# EAGLE design starterkit_v2 (EAGLE 6.5.0)
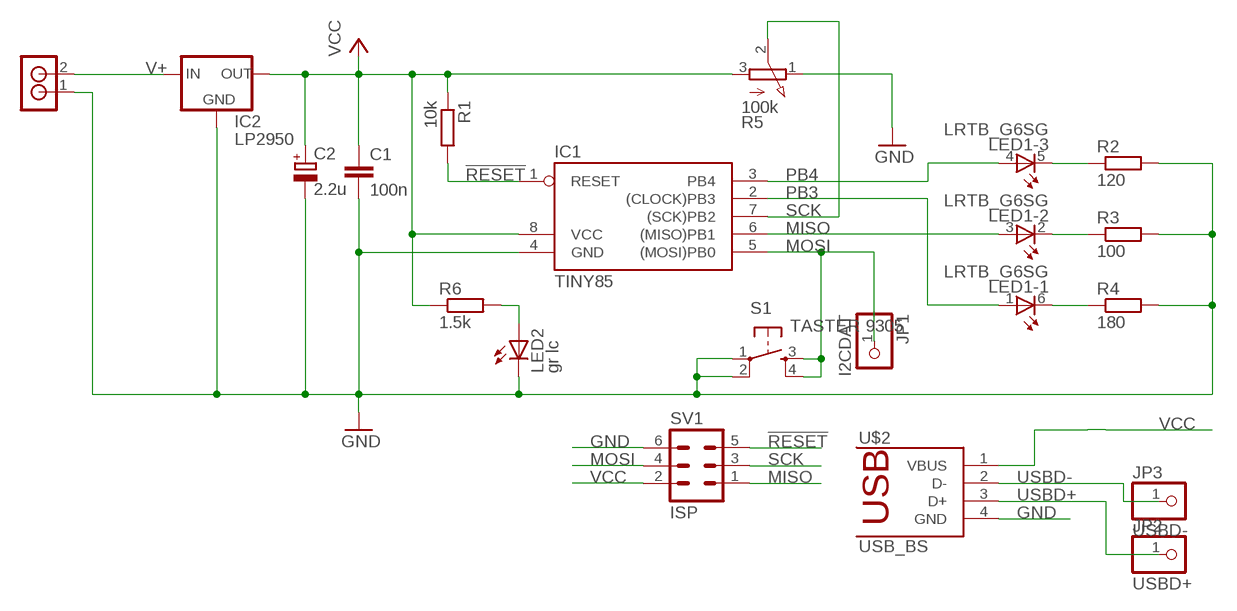
[diagram p0: schematic, sheet 1]

## Parts
C1  100n  C-EUC0805  [C0805]
C2  2.2u  CPOL-EUE2-5  [E2-5]
IC1  TINY85  TINY22P  [DIL08]
IC2  LP2950  LP2950ACZ-5.0  [TO92]
JP1  I2CDAT  PINHD-1X1  [1X01]
JP2  USBD+  PINHD-1X1  [1X01]
JP3  USBD-  PINHD-1X1  [1X01]
LED1  LRTB_G6SG  [LRTB_G6SG]
LED2  gr lc  LED3MM  [LED3MM]
R1  10k  R-EU_R0805  [R0805]
R2  120  R-EU_R0805  [R0805]
R3  100  R-EU_R0805  [R0805]
R4  180  R-EU_R0805  [R0805]
R5  100k  ALPS_RK09K113  [ALPS_RK09K113]
R6  1.5k  R-EU_R0805  [R0805]
S1  TASTER 9305  JTP-1130C  [JTP-1130]
SV1  ISP  ML6  [ML6]
U$1  RIACON_101_2  [RIACON_101_2]
U$2  USB_BS  [USB_B_UP-S]

## Nets
!RESET [signal]: IC1.1(RESET) R1.2 SV1.5
GND [supply]: C1.2 C2.- IC1.4(GND) IC2.2(GND) LED2.K(C) R2.2 R3.2 R4.2 R5.1(E) S1.1(P) S1.2(P1) SV1.6 U$1.1 U$2.4(GND)
MISO [signal]: IC1.6((MISO)PB1) LED1.3(-2:A) SV1.1
MOSI [signal]: IC1.5((MOSI)PB0) JP1.1 S1.3(S) S1.4(S1) SV1.4
N$1 [signal]: LED2.A R6.2
N$5 [signal]: LED1.5(-3:C) R2.1
N$6 [signal]: LED1.2(-2:C) R3.1
N$7 [signal]: LED1.6(-1:C) R4.1
PB3 [signal]: IC1.2((CLOCK)PB3) LED1.1(-1:A)
PB4 [signal]: IC1.3(PB4) LED1.4(-3:A)
SCK [signal]: IC1.7((SCK)PB2) R5.2(S) SV1.3
USBD+: JP2.1 U$2.3(D+)
USBD-: JP3.1 U$2.2(D-)
V+ [supply]: IC2.3(IN) U$1.2
VCC [supply]: C1.1 C2.+ IC1.8(VCC) IC2.1(OUT) R1.1 R5.3(A) R6.1 SV1.2 U$2.1(VBUS)

## Library data of the parts
C1 = rcl:C-EU: CAPACITOR, European symbol
C2 = rcl:CPOL-EU: POLARIZED CAPACITOR, European symbol
IC1 = atmel:TINY22: MICROCONTROLLER 1K ROM 128 bytes RAM 128 bytes EEPROM; OC_FARNELL: unknown; OC_NEWARK: unknown
IC2 = v-reg:LP2950?*: Source: http://cache.national.com/ds/LP/LP2950.pdf
JP1-JP3 = pinhead:PINHD-1X1: PIN HEADER
LED1 = led:LRTB_G6SG: LRTB G6SG 6-lead TOPLED® Source: OSRAM Opto Semiconductors ... LRTB_G6SG_Pb_free.pdf
LED2 = led:LED: LED OSRAM: - CHIPLED LG R971, LG N971, LY N971, LG Q971, LY Q971, LO R971, LY R971 LH N974, LH R974 LS Q976, LO Q976, LY Q976 LO Q996 - Hyper CHIPLED LW Q18S LB Q993, LB Q99A, LB R99A - SideLED LS A670, LO A670, LY A670, LG A670, LP A670 LB A673, LV A673, LT A673, LW A673 LH A674 LY A675 LS A676, LA A676, LO A676, LY A676, LW A676 LS A679, LY A679, LG A679 - Hyper Micro SIDELED® LS Y876, LA Y876, LO Y876, LY Y876 LT Y87S - SmartLED LW L88C, LW L88S LB L89C, LB L89S, LG L890 LS L89K, LO L89K, LY L89K LS L896, LA L896, LO L896, LY L896 - TOPLED LS T670, LO T670, LY T670, LG T670, LP T670 LSG T670, LSP T670, LSY T670, LOP T670, LYG T670 LG T671, LOG T671, LSG T671 LB T673, LV T673, LT T673, LW T673 LH T674 LS T676, LA T676, LO T676, LY T676, LB T676, LH T676, LSB T676, LW T676 LB T67C, LV T67C, LT T67C, LS T67K, LO T67K, LY T67K, LW E67C LS E67B, LA E67B, LO E67B, LY E67B, LB E67C, LV E67C, LT E67C LW T67C LS T679, LY T679, LG T679 LS T770, LO T770, LY T770, LG T770, LP T770 LB T773, LV T773, LT T773, LW T773 LH T774 LS E675, LA E675, LY E675, LS T675 LS T776, LA T776, LO T776, LY T776, LB T776 LHGB T686 LT T68C, LB T68C - Hyper Mini TOPLED® LB M676 - Mini TOPLED Santana® LG M470 LS M47K, LO M47K, LY M47K Source: http://www.osram.convergy.de LUXEON: - LUMILED® LXK2-PW12-R00, LXK2-PW12-S00, LXK2-PW14-U00, LXK2-PW14-V00 LXK2-PM12-R00, LXK2-PM12-S00, LXK2-PM14-U00 LXK2-PE12-Q00, LXK2-PE12-R00, LXK2-PE12-S00, LXK2-PE14-T00, LXK2-PE14-U00 LXK2-PB12-K00, LXK2-PB12-L00, LXK2-PB12-M00, LXK2-PB14-N00, LXK2-PB14-P00, LXK2-PB14-Q00 LXK2-PR12-L00, LXK2-PR12-M00, LXK2-PR14-Q00, LXK2-PR14-R00 LXK2-PD12-Q00, LXK2-PD12-R00, LXK2-PD12-S00 LXK2-PH12-R00, LXK2-PH12-S00 LXK2-PL12-P00, LXK2-PL12-Q00, LXK2-PL12-R00 Source: www.luxeon.com KINGBRIGHT: KA-3528ASYC Source: www.kingbright.com
R1-R4 R6 = rcl:R-EU_: RESISTOR, European symbol
R5 = n39:ALPS_RK09K113: ALPS Drehpoti. linear, 6mm, mono, 10K, vertikal
S1 = n39:JTP-1130: Kurzhubtaster 6x6mm, Höhe: 8,0mm, 12V, vertikal TASTER 9305 <http://www.reichelt.de/?ARTICLE=44586>; REICHELT: TASTER 9305
SV1 = con-ml:ML6: HARTING; OC_FARNELL: unknown; OC_NEWARK: unknown
U$1 = n39:RIACON_101_2: RIACON Anschlussklemme (AKL) Typ 101 Rastermaß 5,08 mm; REICHELT: AKL 101-02
U$2 = n39:USB_B: USB 1.x and 2.x series "B" receptable interface; REICHELT: USB BG

## Net classes
0 default: clearance 0.355 mm
1 supply: width 0.406 mm
2 signal: width 0.254 mm

## Board
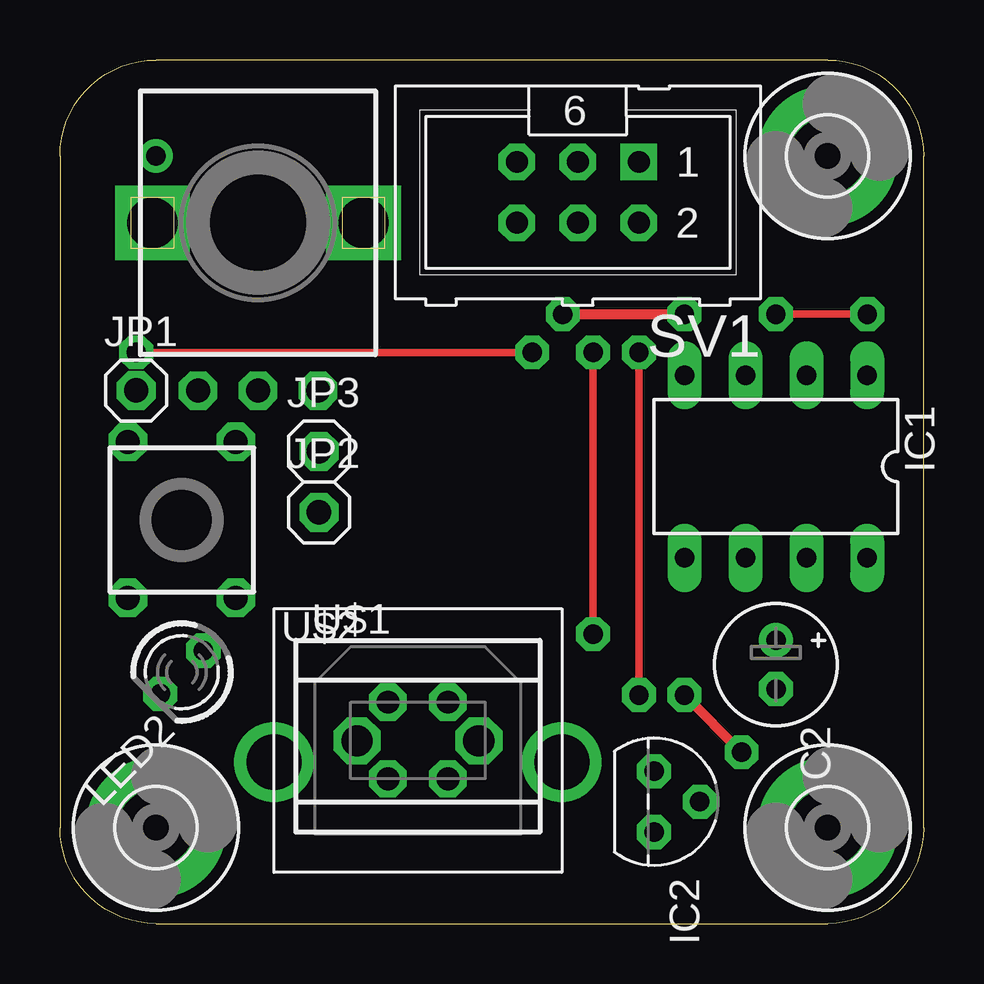
[diagram p1: board, top side]
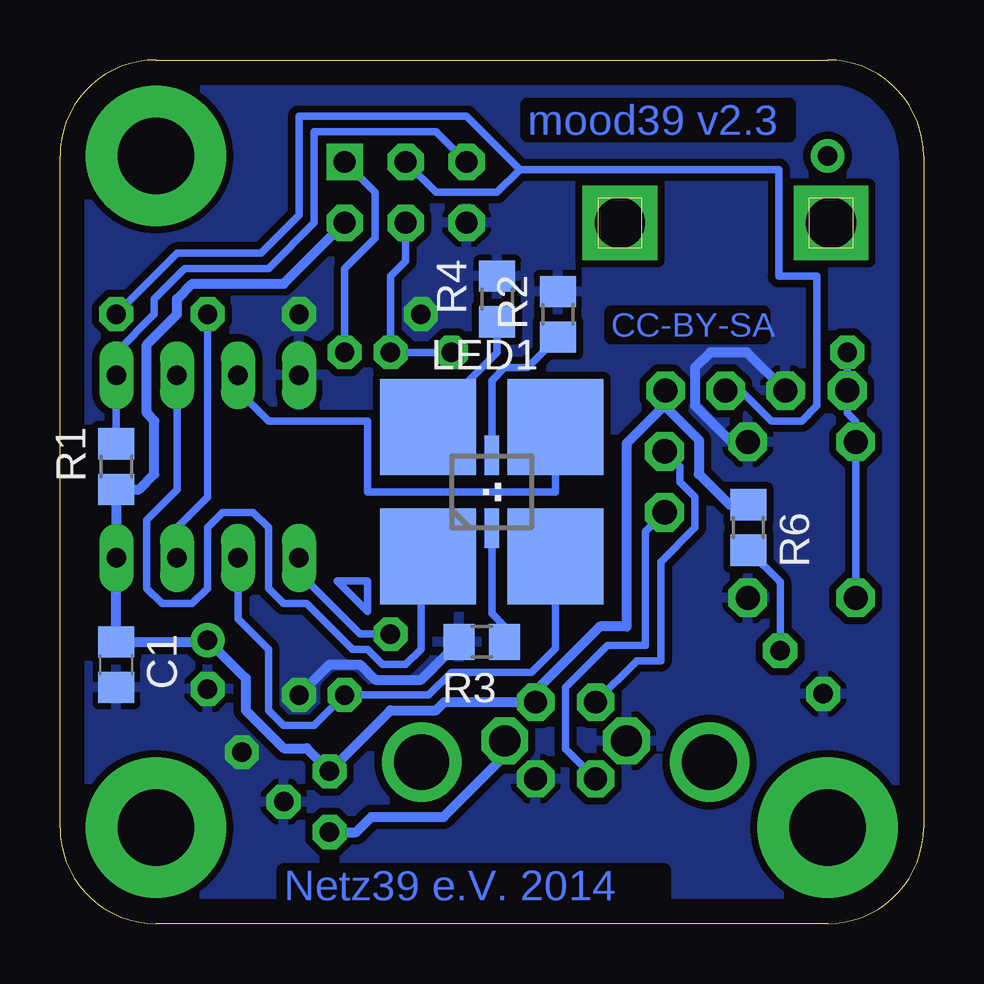
[diagram p2: board, bottom side, seen from below]

Size 36 x 36 mm. Coordinates in mm from the lower left corner, seen from the top.
Outline: 4,0 32,0 arc90 36,4 36,32 arc90 32,36 4,36 arc90 0,32 0,4 arc90 4,0
Copper layers (1*16): Top 0.035mm / dielectric 1.5mm / Bottom 0.035mm
Design rules "starterkit_v2 *": minimum track width 12mil, minimum drill 0.8mm, track to track 12mil, track to pad 12mil, pad to pad 12mil, via to via 12mil, smd to smd 8mil, copper to edge 40mil, drill to drill 12mil, minimum pad ring 12mil, minimum via ring 12mil, stop-mask expansion 4mil, vias tented up to drill 0mil, thermal gap 10mil
bRestrict: area 15.6,1 to 26.7,1.9

### Footprints (pad centres in the part's own frame; a part is rotated, then mirrored left to right if it is on the bottom)
C0805 = smd 1.3 x 1.5: 1 -0.95,0; 2 0.95,0
E2-5 = drill 0.813 pad 1.27: + -1.016,0 | drill 0.813 pad 1.27 octagon: - 1.016,0
DIL08 = drill 0.813 long: 1 -3.81,-3.81; 2 -1.27,-3.81; 3 1.27,-3.81; 4 3.81,-3.81; 5 3.81,3.81; 6 1.27,3.81; 7 -1.27,3.81; 8 -3.81,3.81
TO92 = drill 0.813 octagon: 1 -1.27,0; 2 0,1.905; 3 1.27,0
1X01 = drill 1.016 octagon: 1 0,0
LRTB_G6SG = smd 4 x 4: 1 -2.65,-2.7; 3 2.65,-2.7; 4 2.65,2.7; 6 -2.65,2.7 | smd 0.6 x 1.65: 2 0,-1.525; 5 0,1.525
LED3MM = drill 0.813 octagon: A -1.27,0; K 1.27,0
R0805 = smd 1.3 x 1.5: 1 -0.95,0; 2 0.95,0
ALPS_RK09K113 = drill 1 octagon: 1 -2.5,-7; 2 0,-7; 3 2.5,-7 | drill 2.1 square: P$1 -4.4,0; P$2 4.4,0
JTP-1130 = drill 1 octagon: 1 3.25,-2.25; 2 -3.25,-2.25; 3 3.25,2.25; 4 -3.25,2.25
ML6 = drill 0.914 square: 1 -2.54,-1.27 | drill 0.914 octagon: 2 -2.54,1.27; 3 0,-1.27; 4 0,1.27; 5 2.54,-1.27; 6 2.54,1.27
RIACON_101_2 = drill 1.3 octagon: 1 -2.54,0; 2 2.54,0
USB_B_UP-S = drill 0.95 octagon: 1 1.25,3.2; 2 -1.25,3.2; 3 -1.25,0; 4 1.25,0 | drill 2.3: P$1 6,0.7; P$2 -6,0.7
3,2-PAD = drill 3.2 pad 5.842: B3,2 0,0

### Placement (x,y rotation side)
C1  33.66,10.79 270 bottom
C2  29.84,10.79 270 top
IC1  29.84,19.05 180 top
IC2  24.77,5.08 270 top
JP1  3.17,22.23 0 top
JP2  10.79,17.14 0 top
JP3  10.79,19.68 0 top
LED1  18,18 0 bottom
LED2  5.08,10.48 225 top
R1  33.66,19.05 90 bottom
R2  15.24,25.4 90 bottom
R3  18.41,11.75 180 bottom
R4  17.78,26.04 90 bottom
R5  8.26,29.21 0 top
R6  7.3,16.51 270 bottom
S1  5.08,16.83 90 top
SV1  21.59,30.48 180 top
U$1  14.92,7.62 0 top
U$2  14.92,6.03 0 top
U$4  [3,2-PAD]  32,32 0 top
U$5  [3,2-PAD]  32,4 0 top
U$6  [3,2-PAD]  4,4 0 top

### Tracks (layer width: path | path; a pad name or v marks a point on that pad's centre or on a via)
!RESET
  Bottom 0.305: R1.2 IC1.1 33.66,23.81 32.07,25.4 32.07,26.04 30.8,27.3 27.3,27.3 25.4,29.21 25.4,33.02 20.32,33.02 SV1.5
GND  (via drill 0.8)
  Top 0.406: v26.04,9.53 v28.42,7.14 | v20.95,25.4 v26.04,25.4
  Bottom 0.406: v26.04,9.53 24.77,10.79 23.5,10.79 22.86,10.16 20.95,10.16 R3.2 | R5.1 7.36,23.81 8.89,23.81 9.53,23.18 9.53,21.59 8.01,20.08 S1.1
  pour Bottom: 0,32 arc-90 4,36 32,36 arc-90 36,32 36,4 arc-90 32,0 4,0 arc-90 0,4
MISO  (via drill 0.8)
  Top 0.305: v24.13,9.53 v24.13,23.81
  Bottom 0.305: IC1.6 28.57,12.7 27.3,11.43 27.3,8.89 26.67,8.26 25.4,8.26 v24.13,9.53 20.64,9.53 19.68,10.48 16.35,10.48 15.35,11.48 LED1.3 | v24.13,23.81 24.13,27.3 22.86,28.57 22.86,30.48 SV1.1
MOSI  (via drill 0.8)
  Top 0.305: v3.17,23.81 v19.68,23.81 | v22.23,12.06 v22.23,23.81
  Bottom 0.305: S1.4 S1.3 2.83,20.93 3.17,21.27 JP1.1 v3.17,23.81 | v19.68,23.81 v22.23,23.81 22.23,26.99 21.59,27.62 SV1.4 | IC1.5 26.04,14.61 23.5,12.06 v22.23,12.06
N$1
  Bottom 0.305: R6.2 5.98,14.24 LED2.A
N$5
  Bottom 0.305: R2.1 16.51,23.18 17.46,23.18 18,22.64 LED1.5
N$6
  Bottom 0.305: LED1.2 18,12.92 17.46,12.38 R3.1
N$7
  Bottom 0.305: R4.1 17.78,23.81 19.37,22.23 19.37,21.98 LED1.6
N$16
  Bottom 0.305: 23.18,14.29 23.18,13.02 24.45,14.29 23.18,14.29
N$17  (via drill 0.8)
  other vias: 4,32
PB3
  Bottom 0.305: IC1.2 31.11,18.1 32.38,16.83 32.38,13.97 31.75,13.34 30.48,13.34 29.84,13.97 29.84,16.51 29.21,17.14 27.94,17.14 27.3,16.51 27.3,13.97 26.67,13.34 25.72,13.34 23.81,11.43 23.18,11.43 22.54,10.79 21.59,10.79 20.95,11.43 20.95,14.99 LED1.1
PB4
  Bottom 0.305: LED1.4 15.35,18 23.18,18 23.18,20.95 27.3,20.95 28.57,22.23 IC1.3
SCK  (via drill 0.8)
  Top 0.305: v29.84,25.4 v33.66,25.4
  Bottom 0.305: 16.83,31.43 6.03,31.43 6.03,26.99 4.45,26.99 4.45,21.59 5.08,20.95 6.35,20.95 7.61,22.21 R5.2 | IC1.7 31.11,16.51 29.84,17.78 v29.84,25.4 | 16.83,31.43 19.05,33.66 26.04,33.66 26.04,29.53 27.62,27.94 31.11,27.94 v33.66,25.4 | 16.83,31.43 17.78,30.48 20.32,30.48 SV1.3
USBD+
  Bottom 0.305: JP2.1 11.59,16.35 11.59,11.59 13.18,11.59 14.92,9.84 14.92,7.28 U$2.3
USBD-
  Bottom 0.305: JP3.1 10.16,19.05 10.16,18.41 9.53,17.78 9.53,16.51 10.95,15.08 10.95,10.95 11.95,10.95 U$2.2
V+
  Bottom 0.406: U$1.2 17.46,6.99 20,4.45 23.02,4.45 23.65,3.81 IC2.3
VCC
  Bottom 0.406: C2.+ 29.84,11.75 | C2.+ 29.91,11.74 C1.1 IC1.8 R1.1 32.7,18.1 32.07,18.73 32.07,20.95 32.38,21.27 32.38,24.13 31.11,25.4 31.11,26.04 30.48,26.67 26.67,26.67 SV1.2 | C2.+ 28.26,10.22 28.26,8.89 26.67,7.3 25.72,7.3 IC2.1 22.23,8.89 20.32,8.89 19.98,9.23 U$2.1 | 10.79,21.59 10.79,22.17 R5.3 | 10.79,21.59 12.38,20 12.38,12.38 13.49,12.38 16.17,9.7 U$2.1 | 10.79,21.59 9.37,20.16 9.37,18.73 8.09,17.46 R6.1 | U$2.1

### Text on the board
Bottom: mood39 v2.3 | CC-BY-SA | Netz39 e.V. 2014